# EAGLE design fryza-miedź (EAGLE 9.6.2)
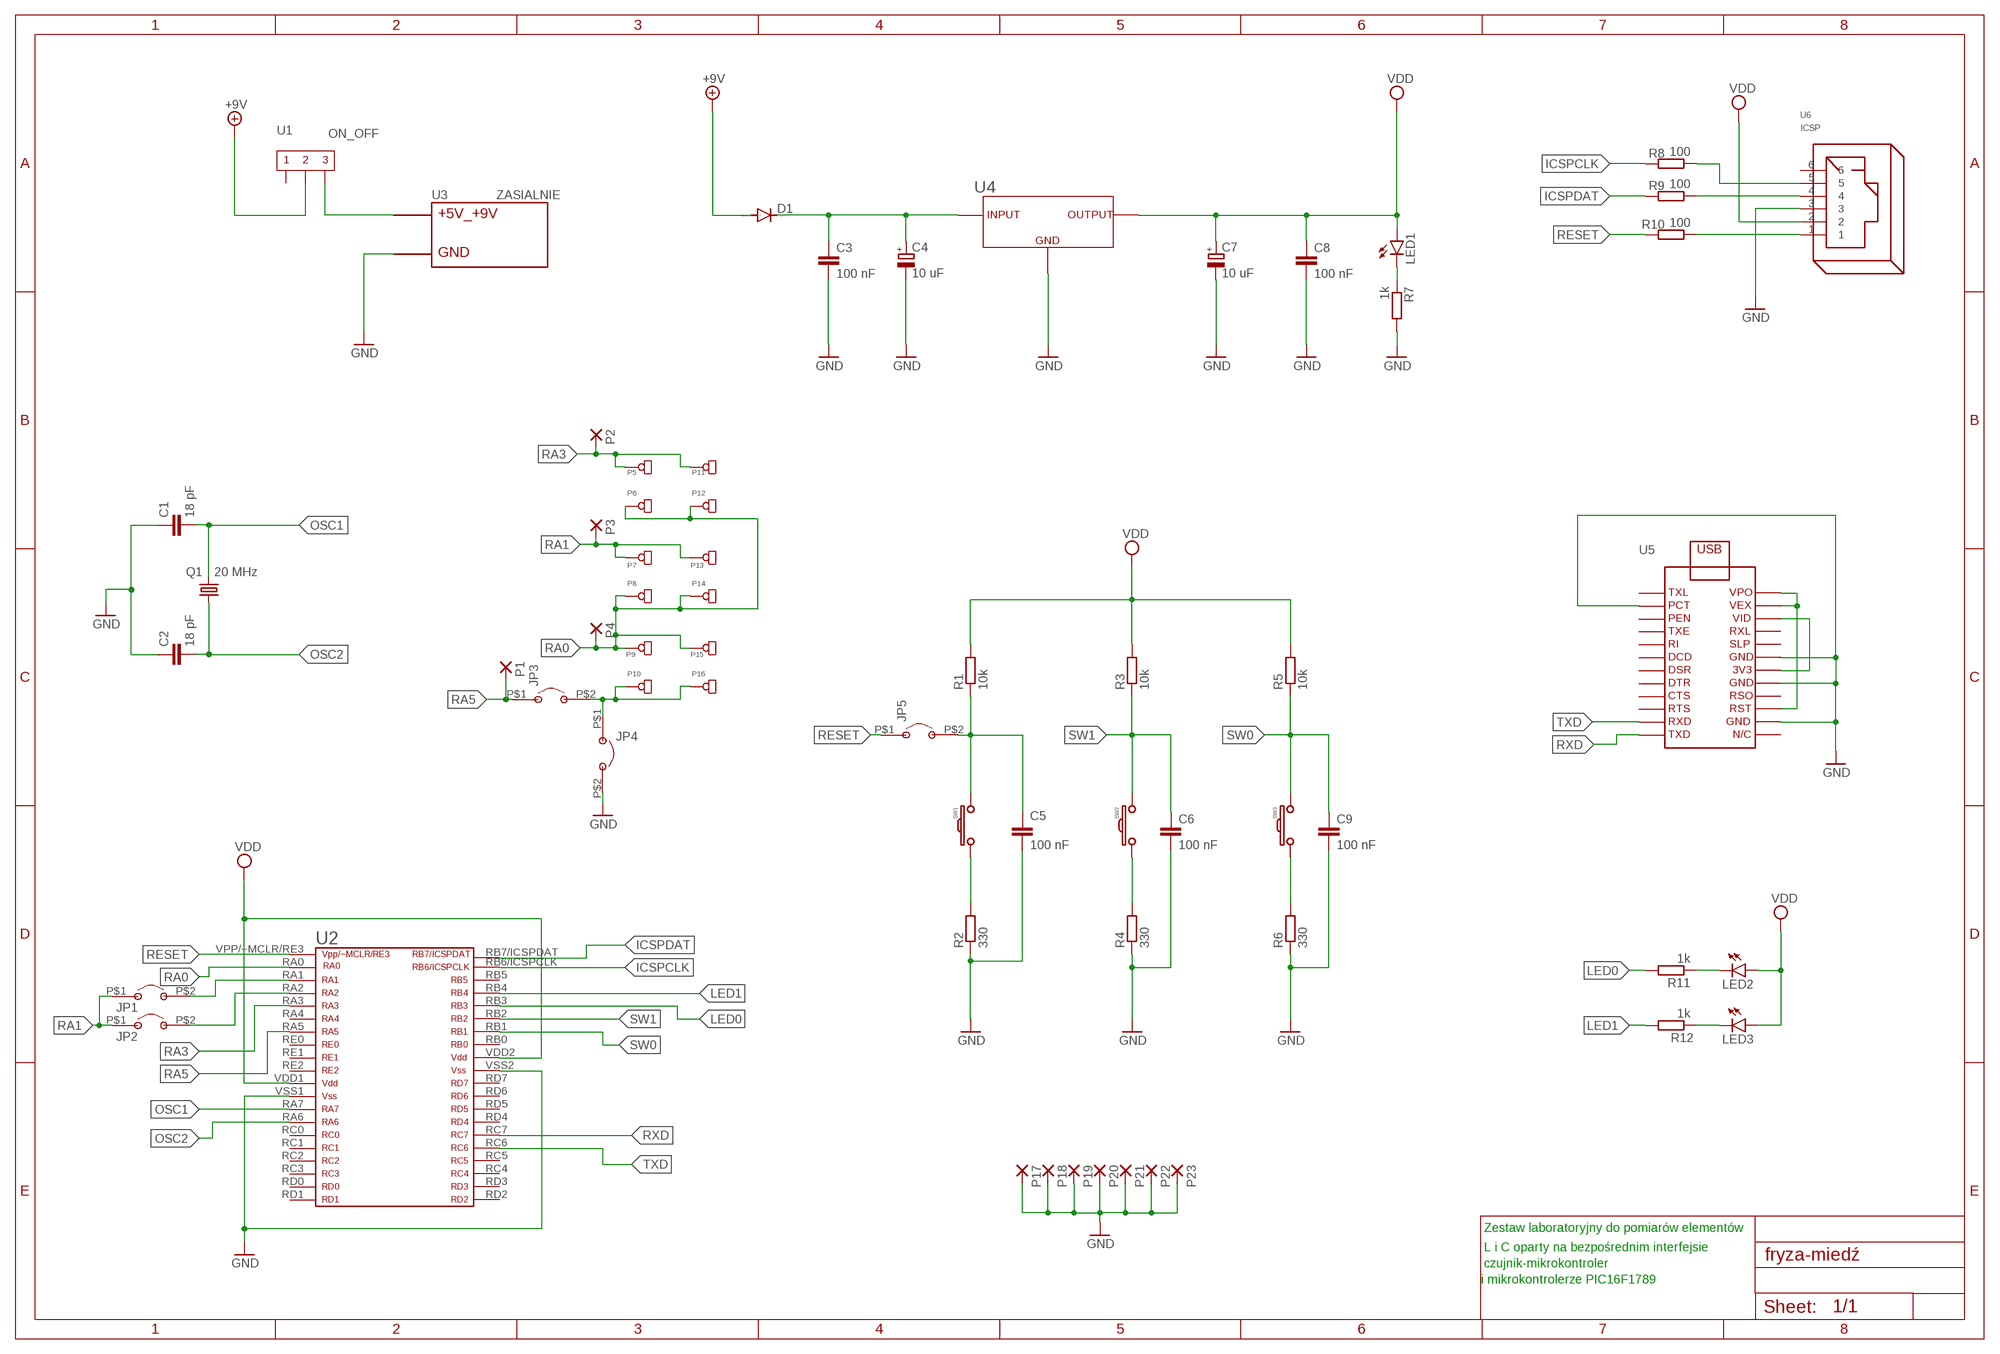
[diagram p0: schematic, sheet 1]

## Parts
C1  18 pF  C-EU050-035X075  [C050-035X075]
C2  18 pF  C-EU050-035X075  [C050-035X075]
C3  100 nF  C-EU050-035X075  [C050-035X075]
C4  10 uF  CPOL-EUE2.5-5  [E2,5-5]
C5  100 nF  C-EU050-035X075  [C050-035X075]
C6  100 nF  C-EU050-035X075  [C050-035X075]
C7  10 uF  CPOL-EUE2.5-5  [E2,5-5]
C8  100 nF  C-EU050-035X075  [C050-035X075]
C9  100 nF  C-EU050-035X075  [C050-035X075]
D1  1N4004  [DO41-10]
JP1  JUMPER  [JUMPER]
JP2  JUMPER  [JUMPER]
JP3  JUMPER  [JUMPER]
JP4  JUMPER  [JUMPER]
JP5  JUMPER  [JUMPER]
LED1  LED5MM  [LED5MM]
LED2  LED5MM  [LED5MM]
LED3  LED5MM  [LED5MM]
P1  SZPILKA  [CON]
P2  SZPILKA  [CON]
P3  SZPILKA  [CON]
P4  SZPILKA  [CON]
P5  CON  [CON]
P6  CON  [CON]
P7  CON  [CON]
P8  CON  [CON]
P9  CON  [CON]
P10  CON  [CON]
P11  CON  [CON]
P12  CON  [CON]
P13  CON  [CON]
P14  CON  [CON]
P15  CON  [CON]
P16  CON  [CON]
P17  SZPILKA  [CON]
P18  SZPILKA  [CON]
P19  SZPILKA  [CON]
P20  SZPILKA  [CON]
P21  SZPILKA  [CON]
P22  SZPILKA  [CON]
P23  SZPILKA  [CON]
Q1  20 MHz  KWARC  [KWARC]
R1  10k  R-EU_0207/10  [0207/10]
R2  330  R-EU_0207/10  [0207/10]
R3  10k  R-EU_0207/10  [0207/10]
R4  330  R-EU_0207/10  [0207/10]
R5  10k  R-EU_0207/10  [0207/10]
R6  330  R-EU_0207/10  [0207/10]
R7  1k  R-EU_0207/10  [0207/10]
R8  100  R-EU_0207/10  [0207/10]
R9  100  R-EU_0207/10  [0207/10]
R10  100  R-EU_0207/10  [0207/10]
R11  1k  R-EU_0207/10  [0207/10]
R12  1k  R-EU_0207/10  [0207/10]
SW1  PUSH_SWITCH  [PUSH_SWITCH]
SW2  PUSH_SWITCH  [PUSH_SWITCH]
SW3  PUSH_SWITCH  [PUSH_SWITCH]
U1  ON_OFF  WLACZNIK  [WLACZNIK]
U2  PIC16F1789  [PIC16F1789]
U3  ZASIALNIE  ZASILANIE_ZLACZE  [ZASILANIE_ZLACZE]
U4  LF33CV  [LF33CV]
U5  MMUSB232  [MMUSB232]
U6  ICSP  RJ12  [RJ12]

## Nets
+9V: D1.A U1.2
GND: C1.1 C2.1 C3.2 C4.- C5.2 C6.2 C7.- C8.2 C9.2 JP4.P$2 P17.P$1(P) P18.P$1(P) P19.P$1(P) P20.P$1(P) P21.P$1(P) P22.P$1(P) P23.P$1(P) R2.1 R4.1 R6.1 R7.2 U2.VSS1 U2.VSS2 U3.GND1(GND) U3.GND2(GND) U4.GND U5.GND U5.GND1 U5.GND2 U5.PCT U6.3
ICSPCLK: R8.2 U2.RB6/ICSPCLK
ICSPDAT: R9.2 U2.RB7/ICSPDAT
LED0: R11.2 U2.RB3
LED1: R12.2 U2.RB4
N$1: C3.1 C4.+ D1.C U4.INPUT
N$2: LED1.K(C) R7.1
N$3: U1.3 U3.V_S(+5V_+9V)
N$4: C5.1 JP5.P$2 R1.1 SW1.1_1 SW1.1_2
N$5: U5.RST U5.VEX U5.VPO
N$6: JP3.P$2 JP4.P$1 P10.P$1 P16.P$1
N$7: LED2.K(C) R11.1
N$8: JP1.P$2 U2.RA1
N$9: LED3.K(C) R12.1
N$10: R10.1 U6.1
N$11: R2.2 SW1.2_1 SW1.2_2
N$12: R6.2 SW3.2_1 SW3.2_2
N$13: R4.2 SW2.2_1 SW2.2_2
N$14: U5.3V3 U5.VIO(VID)
N$15: R8.1 U6.5
N$16: R9.1 U6.4
OSC1: C1.2 Q1.P$2 U2.RA7
OSC2: C2.2 Q1.P$1 U2.RA6
RA0: P4.P$1(P) P6.P$1 P8.P$1 P9.P$1 P12.P$1 P14.P$1 P15.P$1 U2.RA0
RA1: JP1.P$1 JP2.P$1 P3.P$1(P) P7.P$1 P13.P$1
RA2: JP2.P$2 U2.RA2
RA3: P2.P$1(P) P5.P$1 P11.P$1 U2.RA3
RA5: JP3.P$1 P1.P$1(P) U2.RA5
RESET: JP5.P$1 R10.2 U2.VPP/~MCLR/RE3
RXD: U2.RC7 U5.TXD
SW0: C9.1 R5.1 SW3.1_1 SW3.1_2 U2.RB1
SW1: C6.1 R3.1 SW2.1_1 SW2.1_2 U2.RB2
TXD: U2.RC6 U5.RXD
VDD: C7.+ C8.1 LED1.A LED2.A LED3.A R1.2 R3.2 R5.2 U2.VDD1 U2.VDD2 U4.OUTPUT U6.2
Unconnected: U1.1 U2.RA4 U2.RB0 U2.RB5 U2.RC0 U2.RC1 U2.RC2 U2.RC3 U2.RC4 U2.RC5 U2.RD0 U2.RD1 U2.RD2 U2.RD3 U2.RD4 U2.RD5 U2.RD6 U2.RD7 U2.RE0 U2.RE1 U2.RE2 U5.CTS U5.DCD U5.DSR U5.DTR U5.N/C U5.PEN U5.RI U5.RSO U5.RTS U5.RXL U5.SLP U5.TXE U5.TXL U6.6

## Notes on the sheet
- Zestaw laboratoryjny do pomiarów elementów
- L i C oparty na bezpośrednim interfejsie
- czujnik-mikrokontroler
- i mikrokontrolerze PIC16F1789

## Library data of the parts
C1-C3 C5 C6 C8 C9 = rcl:C-EU: CAPACITOR, European symbol; SPICEPREFIX: C
C4 C7 = rcl:CPOL-EU: POLARIZED CAPACITOR, European symbol; SPICEPREFIX: C
D1 = diode:1N4004: DIODE general purpose rectifier, 1 A
JP1-JP5 = PIC16F1789:JUMPER
LED1-LED3 = led:LED: LED OSRAM: - CHIPLED LG R971, LG N971, LY N971, LG Q971, LY Q971, LO R971, LY R971 LH N974, LH R974 LS Q976, LO Q976, LY Q976 LO Q996 - Hyper CHIPLED LW Q18S LB Q993, LB Q99A, LB R99A - SideLED LS A670, LO A670, LY A670, LG A670, LP A670 LB A673, LV A673, LT A673, LW A673 LH A674 LY A675 LS A676, LA A676, LO A676, LY A676, LW A676 LS A679, LY A679, LG A679 - Hyper Micro SIDELED® LS Y876, LA Y876, LO Y876, LY Y876 LT Y87S - SmartLED LW L88C, LW L88S LB L89C, LB L89S, LG L890 LS L89K, LO L89K, LY L89K LS L896, LA L896, LO L896, LY L896 - TOPLED LS T670, LO T670, LY T670, LG T670, LP T670 LSG T670, LSP T670, LSY T670, LOP T670, LYG T670 LG T671, LOG T671, LSG T671 LB T673, LV T673, LT T673, LW T673 LH T674 LS T676, LA T676, LO T676, LY T676, LB T676, LH T676, LSB T676, LW T676 LB T67C, LV T67C, LT T67C, LS T67K, LO T67K, LY T67K, LW E67C LS E67B, LA E67B, LO E67B, LY E67B, LB E67C, LV E67C, LT E67C LW T67C LS T679, LY T679, LG T679 LS T770, LO T770, LY T770, LG T770, LP T770 LB T773, LV T773, LT T773, LW T773 LH T774 LS E675, LA E675, LY E675, LS T675 LS T776, LA T776, LO T776, LY T776, LB T776 LHGB T686 LT T68C, LB T68C - Hyper Mini TOPLED® LB M676 - Mini TOPLED Santana® LG M470 LS M47K, LO M47K, LY M47K Source: http://www.osram.convergy.de LUXEON: - LUMILED® LXK2-PW12-R00, LXK2-PW12-S00, LXK2-PW14-U00, LXK2-PW14-V00 LXK2-PM12-R00, LXK2-PM12-S00, LXK2-PM14-U00 LXK2-PE12-Q00, LXK2-PE12-R00, LXK2-PE12-S00, LXK2-PE14-T00, LXK2-PE14-U00 LXK2-PB12-K00, LXK2-PB12-L00, LXK2-PB12-M00, LXK2-PB14-N00, LXK2-PB14-P00, LXK2-PB14-Q00 LXK2-PR12-L00, LXK2-PR12-M00, LXK2-PR14-Q00, LXK2-PR14-R00 LXK2-PD12-Q00, LXK2-PD12-R00, LXK2-PD12-S00 LXK2-PH12-R00, LXK2-PH12-S00 LXK2-PL12-P00, LXK2-PL12-Q00, LXK2-PL12-R00 Source: www.luxeon.com KINGBRIGHT: KA-3528ASYC Source: www.kingbright.com
P1-P4 P17-P23 = PIC16F1789:SZPILKA
P5-P16 = PIC16F1789:CON
Q1 = PIC16F1789:KWARC
R1-R12 = rcl:R-EU_: RESISTOR, European symbol; SPICEPREFIX: R
SW1-SW3 = PIC16F1789:PUSH_SWITCH
U1 = PIC16F1789:WLACZNIK
U2 = PIC16F1789:PIC16F1789
U3 = PIC16F1789:ZASILANIE_ZLACZE
U4 = PIC16F1789:LF33CV
U5 = PIC16F1789:MMUSB232
U6 = con-rj:RJ12: RJ12, RJ14 and RJ25 RJ12, RJ14 and RJ25 jacks side mounted http://www.tycoelectronics.com

## Board
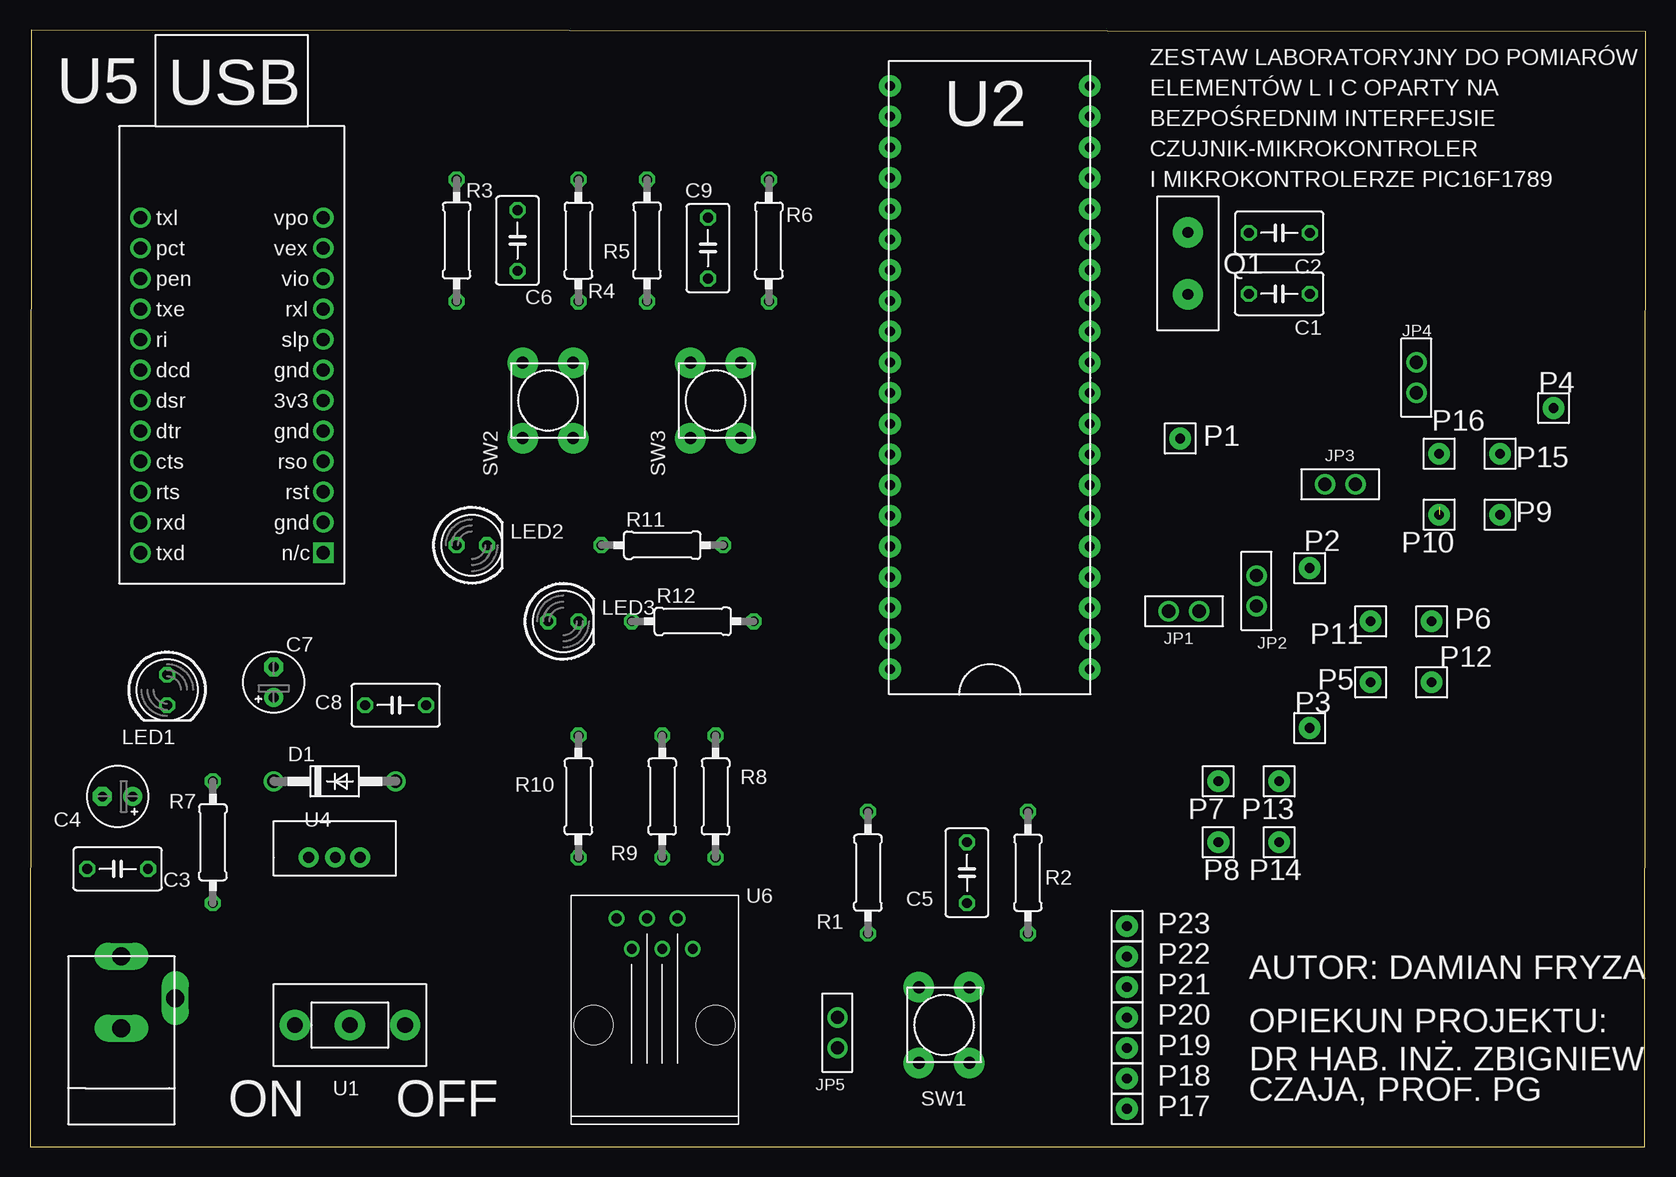
[diagram p1: board, top side]
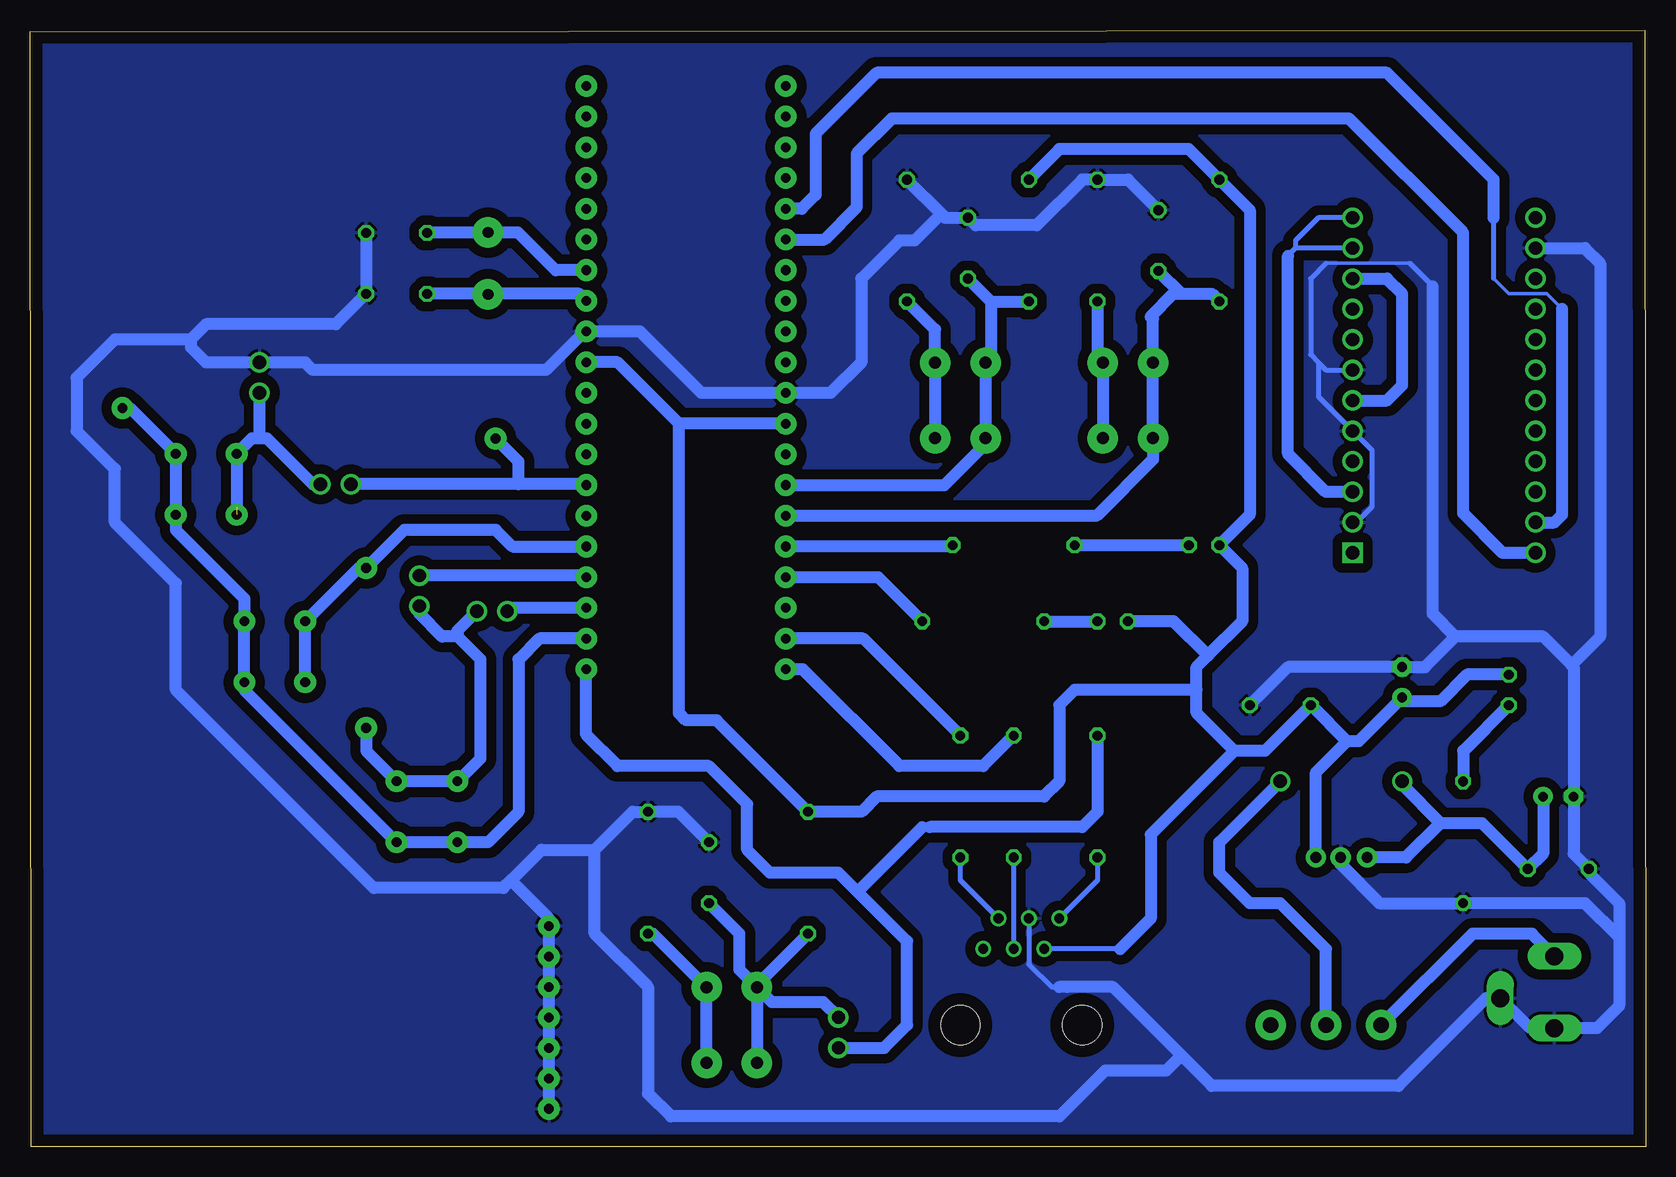
[diagram p2: board, bottom side, seen from below]

Size 134.7 x 93.12 mm. Coordinates in mm from the lower left corner, seen from the top.
Outline: 0,0 134.6,0 134.7,92.99 0.1,93.12 0,0
Copper layers (1*16): Top 0.035mm / dielectric 1.5mm / Bottom 0.035mm
Design rules "default": minimum track width 6mil, minimum drill 0.35mm, track to track 6mil, track to pad 6mil, pad to pad 6mil, via to via 6mil, smd to smd 6mil, copper to edge 40mil, drill to drill 6mil, minimum pad ring 10mil, minimum via ring 8mil, stop-mask expansion 4mil, vias tented up to drill 0mil, thermal gap 10mil

### Footprints (pad centres in the part's own frame; a part is rotated, then mirrored left to right if it is on the bottom)
C050-035X075 = drill 0.813 octagon: 1 -2.54,0; 2 2.54,0
E2,5-5 = drill 0.813 pad 1.6: + -1.27,0 | drill 0.813 pad 1.6 octagon: - 1.27,0
DO41-10 = drill 1.118: A 5.08,0; C -5.08,0
JUMPER = drill 1.1 pad 1.7: P$1 -1.27,0; P$2 1.27,0
LED5MM = drill 0.813 octagon: A -1.27,0; K 1.27,0
CON = drill 0.8 pad 1.8: P$1 0,0
KWARC = drill 0.9 pad 2.54: P$1 -2.58,0; P$2 2.58,0
0207/10 = drill 0.813 octagon: 1 -5.08,0; 2 5.08,0
PUSH_SWITCH = drill 1 pad 2.54: 1_1 -3.15,2.1; 1_2 3.15,2.1; 2_1 -3.15,-2.1; 2_2 3.15,-2.1
WLACZNIK = drill 1.3 pad 2.54: 1 -4.6,0; 2 0,0; 3 4.6,0
PIC16F1789 = drill 0.8 pad 1.8: RA0 8.32,-21.76; RA1 8.32,-19.2; RA2 8.32,-16.64; RA3 8.32,-14.08; RA4 8.32,-11.52; RA5 8.32,-8.96; RA6 8.32,8.96; RA7 8.32,6.4; RB0 -8.32,-6.4; RB1 -8.32,-8.96; RB2 -8.32,-11.52; RB3 -8.32,-14.08; RB4 -8.32,-16.64; RB5 -8.32,-19.2; RB6/ICSPCLK -8.32,-21.76; RB7/ICSPDAT -8.32,-24.32; RC0 8.32,11.52; RC1 8.32,14.08; RC2 8.32,16.64; RC3 8.32,19.2; RC4 -8.32,19.2; RC5 -8.32,16.64; RC6 -8.32,14.08; RC7 -8.32,11.52; RD0 8.32,21.76; RD1 8.32,24.32; RD2 -8.32,24.32; RD3 -8.32,21.76; RD4 -8.32,8.96; RD5 -8.32,6.4; RD6 -8.32,3.84; RD7 -8.32,1.28; RE0 8.32,-6.4; RE1 8.32,-3.84; RE2 8.32,-1.28; VDD1 8.32,1.28; VDD2 -8.32,-3.84; VPP/~MCLR/RE3 8.32,-24.32; VSS1 8.32,3.84; VSS2 -8.32,-1.28
ZASILANIE_ZLACZE = drill 1.5 pad 1.93 long: GND1 0,1; GND2 4.5,3.5; V_S 0,7
LF33CV = drill 0.9 pad 1.676: GND 0.05,0; INPUT -2.16,0; OUTPUT 2.11,0
MMUSB232 = drill 1.1 pad 1.7: 3V3 7.62,-3.81; CTS -7.62,-8.89; DCD -7.62,-1.27; DSR -7.62,-3.81; DTR -7.62,-6.35; GND 7.62,-13.97; GND1 7.62,-6.35; GND2 7.62,-1.27; PCT -7.62,8.89; PEN -7.62,6.35; RI -7.62,1.27; RSO 7.62,-8.89; RST 7.62,-11.43; RTS -7.62,-11.43; RXD -7.62,-13.97; RXL 7.62,3.81; SLP 7.62,1.27; TXD -7.62,-16.51; TXE -7.62,3.81; TXL -7.62,11.43; VEX 7.62,8.89; VIO 7.62,6.35; VPO 7.62,11.43 | drill 1.1 pad 1.7 square: N/C 7.62,-16.51
RJ12 = drill 0.8: 1 -8.89,-3.175; 2 -6.35,-1.905; 3 -8.89,-0.635; 4 -6.35,0.635; 5 -8.89,1.905; 6 -6.35,3.175 | hole 3.25: 0,-5.08; 0,5.08

### Placement (x,y rotation side)
C1  104.14,71.12 180 top
C2  104.14,76.2 180 top
C3  7.3,23.18 180 top
C4  7.3,29.21 180 top
C5  78.11,22.86 90 top
C6  40.64,75.56 90 top
C7  20.32,38.73 90 top
C8  30.48,36.83 0 top
C9  56.52,74.93 90 top
D1  25.4,30.48 0 top
JP1  96.19,44.65 180 top
JP2  102.23,46.35 90 top
JP3  109.22,55.24 0 top
JP4  115.57,64.14 90 top
JP5  67.31,9.53 90 top
LED1  11.43,38.1 270 top
LED2  36.83,50.16 0 top
LED3  44.45,43.81 0 top
P1  95.89,59.05 270 top
P2  106.68,48.26 0 top
P3  106.68,34.92 270 top
P4  127,61.59 0 top
P5  111.76,38.73 0 top
P6  116.84,38.73 0 top
P7  99.06,30.48 270 top
P8  99.06,25.4 270 top
P9  122.56,52.7 0 top
P10  117.47,52.7 0 top
P11  111.76,43.81 0 top
P12  116.84,43.81 0 top
P13  104.14,30.48 270 top
P14  104.14,25.4 270 top
P15  122.56,57.78 90 top
P16  117.47,57.78 0 top
P17  91.44,3.17 270 top
P18  91.44,5.71 270 top
P19  91.44,8.26 270 top
P20  91.44,10.79 270 top
P21  91.44,13.34 270 top
P22  91.44,15.88 270 top
P23  91.44,18.41 270 top
Q1  96.52,73.66 270 top
R1  69.85,22.86 90 top
R2  83.19,22.86 270 top
R3  35.56,75.56 90 top
R4  45.72,75.56 270 top
R5  51.44,75.56 90 top
R6  61.59,75.56 270 top
R7  15.24,25.4 270 top
R8  57.15,29.21 90 top
R9  52.7,29.21 90 top
R10  45.72,29.21 90 top
R11  52.7,50.16 0 top
R12  55.24,43.81 0 top
SW1  76.2,10.16 90 top
SW2  43.18,62.23 90 top
SW3  57.15,62.23 90 top
U1  26.67,10.16 180 top
U2  80.01,64.14 0 top
U3  7.62,8.89 0 top
U4  25.4,24.13 0 top
U5  16.83,66.04 0 top
U6  52.07,10.16 270 top

### Tracks (layer width: path | path; a pad name or v marks a point on that pad's centre or on a via)
+9V
  Bottom 1.016: D1.A 35.56,25.4 35.56,22.86 33.02,20.32 30.48,20.32 26.67,16.51 U1.2
GND
  Bottom 0.305: 19.68,73.66 26.67,73.66
  Bottom 0.406: 17.78,71.75 19.68,73.66 | 26.67,73.66 27.94,72.39 27.94,66.04 27.3,65.41 | 27.3,65.41 26.67,64.77 U5.GND2 | 27.3,65.41 27.3,62.55 U5.GND1 22.86,58.1 22.86,53.34 24.13,52.07 U5.GND | U6.3 51.44,15.24 49.53,13.34 48.26,13.34
  Bottom 1.016: 2.22,17.46 2.22,20.32 4.76,22.86 C3.2 6.03,24.45 C4.- 6.03,40.01 6.19,40.16 | 2.22,17.46 2.22,11.75 4.08,9.89 U3.GND1 9.62,9.89 U3.GND2 13.33,12.39 20.64,5.08 36.2,5.08 38.73,7.62 | 2.22,17.46 5.08,20.32 R7.2 22.23,20.32 25.45,23.55 U4.GND | C8.2 29.84,40.01 C7.- 18.41,40.01 15.88,42.55 | 15.88,42.55 8.57,42.55 6.19,40.16 | U5.PCT 5.08,74.93 3.81,73.66 3.81,42.55 6.19,40.16 | 15.88,42.55 17.78,44.45 17.78,71.75 | 38.73,7.62 44.45,13.34 48.26,13.34 48.9,13.34 | C5.2 80.64,27.94 R2.1 84.45,27.94 87.63,24.77 | 38.73,7.62 40.01,6.35 45.09,6.35 48.9,2.54 81.28,2.54 83.19,4.45 83.19,13.34 87.63,17.78 87.63,24.77 | P17.P$1 P23.P$1 91.44,19.05 94.61,22.23 | C6.2 43.18,80.64 R4.1 46.99,80.64 50.8,76.83 55.88,76.83 C9.2 58.42,77.47 58.74,77.79 | R6.1 58.74,77.79 | 58.74,77.79 60.96,75.56 62.23,75.56 65.41,72.39 65.41,65.41 67.95,62.85 U2.VSS2 78.73,62.85 83.85,67.97 U2.VSS1 | U2.VSS1 88.36,67.94 | 94.61,22.23 95.25,21.59 106.05,21.59 122.56,38.1 122.56,46.99 127.64,52.07 127.64,56.52 130.81,59.69 130.81,64.14 127.64,67.31 121.28,67.31 | 94.61,22.23 92.08,24.77 87.63,24.77 | C2.1 C1.1 109.22,68.58 120.02,68.58 121.28,67.31 | 121.28,67.31 121.28,66.67 120.02,65.41 JP4.P$2 111.76,65.41 111.12,64.77 91.69,64.77 88.49,67.97 U2.VSS1
  pour Bottom (isolate 0.813): -7.62,93.98 -7.62,-5.08 142.24,-5.08 144.78,-2.54 144.78,91.44 134.62,101.6 0,101.6
ICSPCLK
  Bottom 1.016: R8.2 65.23,42.38 U2.RB6/ICSPCLK
ICSPDAT
  Bottom 1.016: R9.2 55.24,31.75 62.23,31.75 70.3,39.81 U2.RB7/ICSPDAT
LED0
  Bottom 1.016: R11.2 57.9,50.05 U2.RB3
LED1
  Bottom 1.016: U2.RB4 64,47.49 R12.2
N$1
  Bottom 1.016: C4.+ 8.57,24.45 C3.1 13.65,26.99 17.14,26.99 | 17.14,26.99 20.32,30.16 D1.C | U4.INPUT 20,24.13 17.14,26.99
N$2
  Bottom 1.016: LED1.K 15.24,33.02 R7.1
N$3
  Bottom 1.016: U3.V_S 9.51,17.78 14.45,17.78 U1.3
N$4
  Bottom 1.016: R1.1 74.1,13.53 SW1.1_2 | SW1.1_2 75.56,14.78 75.56,17.78 C5.1 | SW1.1_2 SW1.1_1 | JP5.P$2 68.58,12.06 72.86,12.06 SW1.1_2
N$5
  Bottom 0.406: U5.VEX 29.21,74.93 | 29.21,74.93 29.84,74.3 | U5.VPO 27.3,77.47 29.21,75.56 29.21,74.93
  Bottom 1.016: U5.RST 26.67,54.61 29.84,57.78 29.84,74.3
N$6  (1 unrouted)
  Bottom 1.016: 117.47,53.34 P16.P$1 116.2,59.05 115.57,59.05 | JP3.P$2 111.12,55.24 114.94,59.05 115.57,59.05 | 115.57,59.05 JP4.P$1
N$7
  Bottom 1.016: R11.1 LED2.K
N$8
  Bottom 1.016: U2.RA1 94.64,44.94 JP1.P$2
N$9
  Bottom 1.016: R12.1 LED3.K
N$10
  Bottom 0.406: R10.1 45.72,22.23 U6.1
N$11
  Bottom 1.016: SW1.2_1 SW1.2_2 82.77,17.78 R2.2
N$12
  Bottom 1.016: SW3.2_1 SW3.2_2 59.25,68.14 R6.2
N$13
  Bottom 1.016: SW2.2_1 SW2.2_2 45.72,65.82 R4.2
N$14
  Bottom 1.016: U5.VIO 21.59,72.39 20.32,71.12 20.32,63.5 21.59,62.23 U5.3V3
N$15
  Bottom 0.406: U6.5 57.15,22.23 R8.1
N$16
  Bottom 0.406: R9.1 U6.4
OSC1
  Bottom 1.016: Q1.P$2 96.56,71.12 | 96.56,71.12 C1.2 | U2.RA7 88.92,71.12 96.56,71.12
OSC2
  Bottom 1.016: C2.2 101.56,76.24 Q1.P$1 94.02,76.24 90.88,73.09 U2.RA6
RA0
  Bottom 1.016: U2.RA0 92.25,42.38 93.98,40.64 93.98,27.94 96.52,25.4 P8.P$1 P14.P$1 116.84,38.1 P6.P$1 116.84,43.18 116.52,43.5 P12.P$1 116.84,45.72 122.56,51.44 P9.P$1 P15.P$1 126.36,61.59 P4.P$1
RA1
  Bottom 1.016: 99.06,42.55 100.33,42.55 102.23,44.45 JP2.P$1 | P3.P$1 106.68,33.02 P13.P$1 P7.P$1 97.16,32.38 97.16,40.64 99.06,42.55 | JP1.P$1 99.06,43.05 99.06,42.55
RA2
  Bottom 1.016: U2.RA2 88.46,47.62 JP2.P$2
RA3
  Bottom 1.016: 88.44,50.16 U2.RA3 94.5,50.05 95.89,51.44 103.5,51.44 P2.P$1 107.31,48.26 P11.P$1 P5.P$1
RA5
  Bottom 1.016: U2.RA5 88.4,55.24 93.98,55.24 | 93.98,55.24 JP3.P$1 | 93.98,55.24 93.98,57.15 P1.P$1
RESET
  Bottom 0.406: 59.69,26.67 60.33,26.67
  Bottom 1.016: JP5.P$1 63.5,8.26 61.59,10.16 61.59,17.14 65.72,21.27 | 65.72,21.27 67.31,22.86 73.03,22.86 74.93,24.77 74.93,28.57 78.11,31.75 85.72,31.75 88.33,34.35 U2.VPP/~MCLR/RE3 | 60.33,26.67 65.72,21.27 | R10.2 45.72,27.94 46.99,26.67 59.69,26.67
RXD
  Bottom 1.016: U2.RC7 68.49,75.66 65.79,78.36 65.79,82.8 62.87,85.72 24.77,85.72 15.24,76.2 15.24,52.83 11.94,49.53 U5.TXD
SW0
  Bottom 1.016: C9.1 54.61,70.48 | 54.61,70.48 R5.1 | 54.61,70.48 54.61,65.82 SW3.1_2 SW3.1_1 55.05,58.62 58.49,55.17 U2.RB1
SW1
  Bottom 1.016: C6.1 38.73,71.12 | R3.1 36.2,71.12 38.73,71.12 | 38.73,71.12 39.37,71.12 41.27,69.22 41.08,69.02 SW2.1_2 SW2.1_1 41.08,57.34 45.81,52.62 U2.RB2
TXD
  Bottom 0.305: 6.99,69.85 8.26,71.12 11.43,71.12 12.7,72.39
  Bottom 0.406: 12.7,72.39 12.7,77.47
  Bottom 1.016: 12.7,77.47 12.7,80.64 21.59,89.53 64.14,89.53 69.22,84.45 69.22,79.38 70.38,78.22 U2.RC6 | U5.RXD 7.62,52.07 6.99,52.7 6.99,69.85
VDD
  Bottom 0.406: 43.81,16.51 U6.2
  Bottom 1.016: 24.92,33.81 C8.1 31.75,33.02 34.29,33.02 | LED1.A 14.92,39.37 17.14,37.15 20,37.15 C7.+ 23.97,33.81 24.92,33.81 | 36.51,40.96 37.47,40.01 37.47,38.1 | 36.51,40.96 33.66,43.81 33.66,48.26 LED2.A 33.02,52.7 33.02,78.11 R3.2 38.1,83.19 48.9,83.19 R5.2 | 34.29,33.02 37.47,36.2 37.47,38.1 | 34.29,33.02 41.27,26.04 41.27,19.05 43.81,16.51 | 37.47,38.1 47.62,38.1 48.9,36.83 48.9,30.48 50.16,29.21 64.14,29.21 65.41,27.94 R1.2 77.47,35.56 80.01,35.56 80.61,36.16 80.61,60.3 | LED3.A 39.37,43.81 36.51,40.96 | U2.VDD2 80.61,60.3 | U2.VDD1 85.73,65.42 80.61,60.3 | U4.OUTPUT 27.51,31.23 24.92,33.81

### Text on the board
tPlace: ZESTAW LABORATORYJNY DO POMIARÓW | ELEMENTÓW L I C OPARTY NA | BEZPOŚREDNIM INTERFEJSIE | CZUJNIK-MIKROKONTROLER | I MIKROKONTROLERZE PIC16F1789 | AUTOR: DAMIAN FRYZA | OPIEKUN PROJEKTU: | DR HAB. INŻ. ZBIGNIEW | CZAJA, PROF. PG | ON | OFF